# Altium schematic sheet rfm.SchDoc
size A4
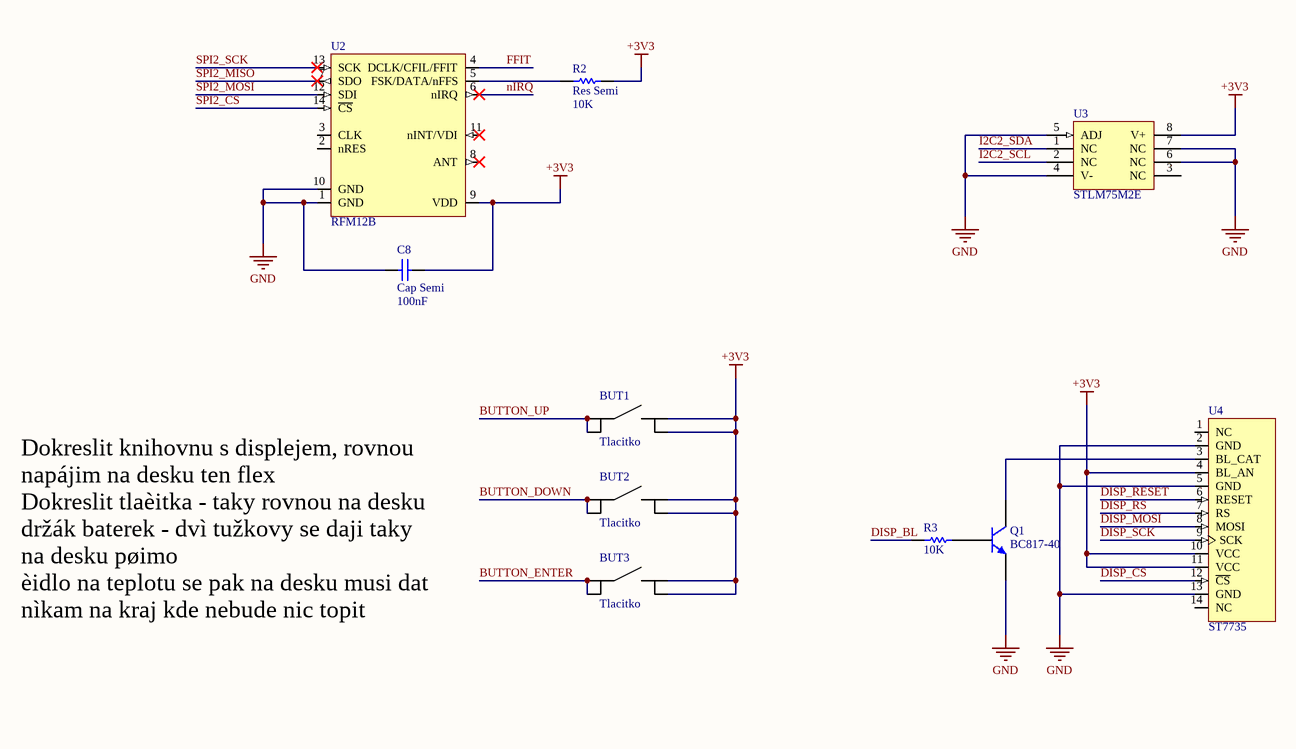
[diagram p0: rfm.SchDoc]

## Parts
BUT1  Tlacitko  [TLACITKO]
BUT2  Tlacitko  [TLACITKO]
BUT3  Tlacitko  [TLACITKO]
C8  Cap Semi  value 100nF  [CAPC3216L]
Q1  BC817-40  [SOT-23A]
R2  Res Semi  value 10K  [RESC2012L]
R3  value 10K  [RESC2012L]  (hidden comment: Res Semi)
U2  RFM12B  [PCBComponent_1]
U3  STLM75M2E  [SO8_M]
U4  ST7735  [ST7735_DESKA]

## Nets
+3V3: BUT1.3 BUT1.4 BUT2.3 BUT2.4 BUT3.3 BUT3.4 C8.1 R2.2 U2.9(VDD) U3.8(V+) U4.4(BL_AN) U4.10(VCC) U4.11(VCC)
GND: C8.2 Q1.2(E) U2.1(GND) U2.10(GND) U3.4(V-) U3.5(ADJ) U3.6(NC) U3.7(NC) U4.2(GND) U4.5(GND) U4.13(GND)
BUTTON_DOWN: BUT2.1 BUT2.2
BUTTON_ENTER: BUT3.1 BUT3.2
BUTTON_UP: BUT1.1 BUT1.2
DISP_BL: R3.2
DISP_CS: U4.12(~{CS})
DISP_MOSI: U4.8(MOSI)
DISP_RESET: U4.6(RESET)
DISP_RS: U4.7(RS)
DISP_SCK: U4.9(SCK)
FFIT: U2.4(DCLK/CFIL/FFIT)
I2C2_SCL: U3.2(NC)
I2C2_SDA: U3.1(NC)
nIRQ: U2.6(nIRQ)
SPI2_CS: U2.14(~{CS})
SPI2_MISO: U2.7(SDO)
SPI2_MOSI: U2.12(SDI)
SPI2_SCK: U2.13(SCK)
NetQ1_1: Q1.1(B) R3.1
NetQ1_3: Q1.3(C) U4.3(BL_CAT)
NetR2_1: R2.1 U2.5(FSK/DATA/nFFS)

Not connected (* = marked no-connect by the designer): U2 2(nRES) 3(CLK) 8(ANT)* 11(nINT/VDI)*; U3 3(NC); U4 1(NC) 14(NC)

## Notes on the sheet
- Dokreslit knihovnu s displejem, rovnou napájim na desku ten flex
  Dokreslit tlaèitka - taky rovnou na desku
  držák baterek - dvì tužkovy se daji taky na desku pøimo
  èidlo na teplotu se pak na desku musi dat nìkam na kraj kde nebude nic topit

## Library data of the parts
C8 = Cap Semi: Capacitor (Semiconductor SIM Model); Published: 8-Jun-2000; LatestRevisionDate: 29-May-2009; LatestRevisionNote: IPC-7351 Footprint Added.; PackageReference: C1206; Publisher: Altium Limited; PackageDescription: Chip Capacitor
Q1 = BC817-40: NPN General Purpose Amplifier; Published: 8-Jun-2000; LatestRevisionDate: 17-Jul-2002; LatestRevisionNote: Re-released for DXP Platform.; DatasheetDocument: 1997; PackageDocument: Sep-1998; PackageReference: SOT-23A; Publisher: Altium Limited; ComponentLink1Description: Manufacturer Link; ComponentLink1URL: http://www.fairchildsemi.com/; ComponentLink2Description: Discontinuation Notice; ComponentLink2URL: http://www.fairchildsemi.com/obsolete/obs.jsp
R2 R3 = Res Semi: Semiconductor Resistor; Published: 8-Jun-2000; LatestRevisionDate: 17-Jul-2002; LatestRevisionNote: Re-released for DXP Platform.; PackageReference: AXIAL-0.5; Publisher: Altium Limited
U3 = LM335AD: Precision Temperature Sensor; Published: 24-Aug-2001; LatestRevisionDate: 13-Apr-2006; LatestRevisionNote: IPC-7351 Footprint Added.; DatasheetVersion: Oct-1997; PackageVersion: Dec-2002; PackageReference: SO8; Publisher: Altium Limited; PackageDescription: 8-Pin Small Outline Integrated Circuit 1.27 mm Pitch; Code_JEDEC: MS-012-AA; Code_IPC: SOIC127P600-8; ComponentLink1Description: Manufacturer Link; ComponentLink1URL: http://www.st.com/; ComponentLink2Description: Datasheet; ComponentLink2URL: http://www.st.com/stonline/products/literature/ds/2158/lm235.pdf